# EAGLE schematic sumorobot-wifi-pcb (EAGLE 7.1.0)
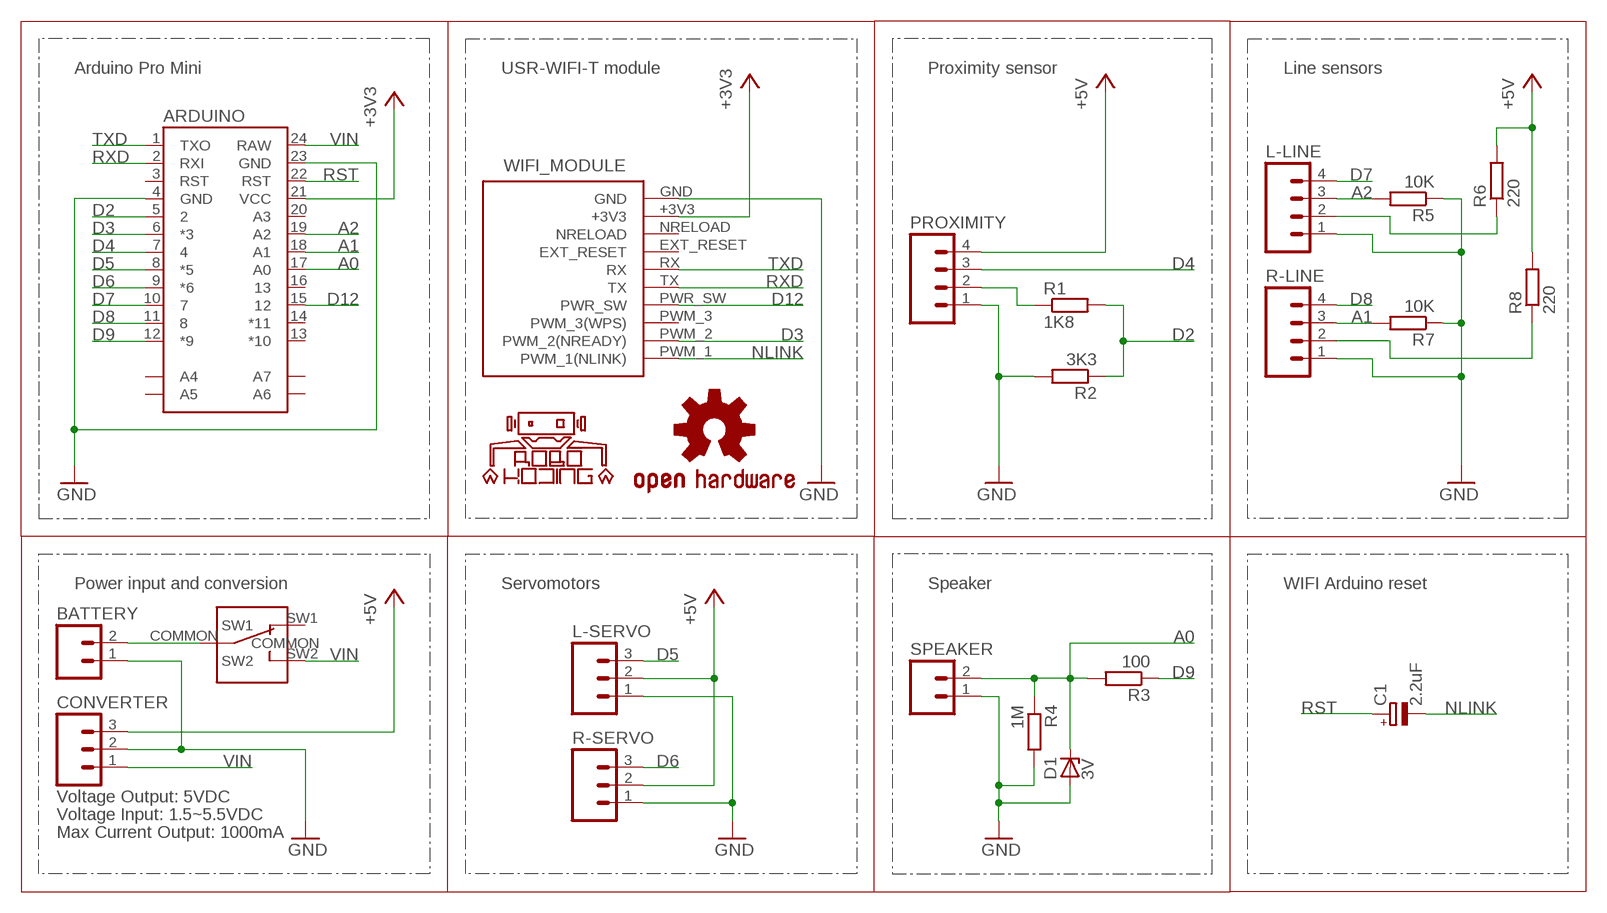
[diagram p0: schematic, sheet 1]

## Parts
ARDUINO  ARDUINO_PRO_MINI  [ARDUINO_PRO_MINI]
BATTERY  M02JST-PTH-VERT  [JST-2-PTH-VERT]
C1  2.2uF  CPOL-EUE2-5  [E2-5]
CONVERTER  M03LOCK_LONGPADS  [1X03_LOCK_LONGPADS]
D1  3V  1N821  [DO35Z10]
L-LINE  M04LOCK_LONGPADS  [1X04_LOCK_LONGPADS]
L-SERVO  M03LOCK_LONGPADS  [1X03_LOCK_LONGPADS]
LOGO1  OSHW-LOGOM  [OSHW-LOGO-M]
LOGO2  ROBOKODING-LOGOM  [ROBOKODING-LOGO-M]
POWER  SPDT_SLIDE_SWITCH  [SPDT_SLIDE_SWITCH]
PROXIMITY  M04LOCK_LONGPADS  [1X04_LOCK_LONGPADS]
R1  1K8  R-EU_0204/5  [0204/5]
R2  3K3  R-EU_0204/5  [0204/5]
R3  100  R-EU_0204/5  [0204/5]
R4  1M  R-EU_0204/5  [0204/5]
R5  10K  R-EU_0204/5  [0204/5]
R6  220  R-EU_0204/5  [0204/5]
R7  10K  R-EU_0204/5  [0204/5]
R8  220  R-EU_0204/5  [0204/5]
R-LINE  M04LOCK_LONGPADS  [1X04_LOCK_LONGPADS]
R-SERVO  M03LOCK_LONGPADS  [1X03_LOCK_LONGPADS]
SPEAKER  M02LOCK_LONGPADS  [1X02_LOCK_LONGPADS]
WIFI_MODULE  USR_WIFI-T  [WIFI_MODULE-T]

## Nets
+3V3: ARDUINO.21(VCC) WIFI_MODULE.+3V3
+5V: CONVERTER.3 L-SERVO.2 PROXIMITY.4 R6.2 R8.2 R-SERVO.2
A0: ARDUINO.17(A0) D1.C R3.2 R4.1 SPEAKER.2
A1: ARDUINO.18(A1) R7.2 R-LINE.3
A2: ARDUINO.19(A2) L-LINE.3 R5.2
BAT_IN: BATTERY.2 POWER.COMMON
D2: ARDUINO.5 R1.2 R2.1
D3: ARDUINO.6(*3) WIFI_MODULE.PWM_2(PWM_2(NREADY))
D4: ARDUINO.7 PROXIMITY.3
D5: ARDUINO.8(*5) L-SERVO.3
D6: ARDUINO.9(*6) R-SERVO.3
D7: ARDUINO.10 L-LINE.4
D8: ARDUINO.11 R-LINE.4
D9: ARDUINO.12(*9) R3.1
D12: ARDUINO.15 WIFI_MODULE.PWR_SW
GND: ARDUINO.4(GND) ARDUINO.23(GND) BATTERY.1 CONVERTER.2 D1.A L-LINE.1 L-SERVO.1 PROXIMITY.1 R2.2 R4.2 R5.1 R7.1 R-LINE.1 R-SERVO.1 SPEAKER.1 WIFI_MODULE.GND
N$1: PROXIMITY.2 R1.1
N$6: L-LINE.2 R6.1
N$7: R8.1 R-LINE.2
NLINK: C1.- WIFI_MODULE.PWM_1(PWM_1(NLINK))
RST: ARDUINO.22(RST) C1.+
RXD: ARDUINO.2(RXI) WIFI_MODULE.TX
TXD: ARDUINO.1(TXO) WIFI_MODULE.RX
VIN: ARDUINO.24(RAW) CONVERTER.1 POWER.SW2
Unconnected: ARDUINO.3(RST) ARDUINO.13(*10) ARDUINO.14(*11) ARDUINO.16 ARDUINO.20(A3) POWER.SW1 WIFI_MODULE.EXT_RESET WIFI_MODULE.NRELOAD WIFI_MODULE.PWM_3(PWM_3(WPS))

## Notes on the sheet
- Arduino Pro Mini | USR-WIFI-T module | Proximity sensor | Line sensors
- Power input and conversion | Servomotors | Speaker | WIFI Arduino reset
- Voltage Output: 5VDC
- Voltage Input: 1.5~5.5VDC
- Max Current Output: 1000mA

## Library data of the parts
ARDUINO = SparkFun-Boards:ARDUINO_PRO_MINI
BATTERY SPEAKER = SparkFun-Connectors:M02: Standard 2-pin 0.1" header. Use with - straight break away headers ( PRT-00116) - right angle break away headers (PRT-00553) - swiss pins (PRT-00743) - machine pins (PRT-00117) - female headers (PRT-00115) Molex polarized connector foot print use with: PRT-08233 with associated crimp pins and housings. 2.54_SCREWTERM for use with PRT-10571. 3.5mm Screw Terminal footprints for PRT-08084 5mm Screw Terminal footprints for use with PRT-08432
C1 = Child-Friendly-Parts:CPOL-EU: POLARIZED CAPACITOR, European symbol
CONVERTER L-SERVO R-SERVO = SparkFun-Connectors:M03: Header 3 Standard 3-pin 0.1" header. Use with straight break away headers (SKU : PRT-00116), right angle break away headers (PRT-00553), swiss pins (PRT-00743), machine pins (PRT-00117), and female headers (PRT-00115). Molex polarized connector foot print use with SKU : PRT-08232 with associated crimp pins and housings.
D1 = diode:1N821: Reference DIODE temperature compensated, 6,2 V
L-LINE PROXIMITY R-LINE = SparkFun-Connectors:M04: Header 4 Standard 4-pin 0.1" header. Use with straight break away headers (SKU : PRT-00116), right angle break away headers (PRT-00553), swiss pins (PRT-00743), machine pins (PRT-00117), and female headers (PRT-00115). Molex polarized connector foot print use with SKU : PRT-08231 with associated crimp pins and housings. 1MM SMD Version SKU: PRT-10208
LOGO1 = SparkFun-Aesthetics:OSHW-LOGO: Open Source Hardware Logo This logo indicates the piece of hardware it is found on incorporates a OSHW license and/or adheres to the definition of open source hardware found here: http://freedomdefined.org/OSHW
LOGO2 = Sumorobot:ROBOKODING-LOGO: Robokoding logo This logo indicates that the piece of hardware was developed by the RoboKoding community. RoboKoding is a organisation that focuses on teaching everyone building and programming robots: http://www.robokoding.com
POWER = custom:SPDT_SLIDE_SWITCH
R1-R8 = Child-Friendly-Parts:R-EU_: RESISTOR, European symbol
WIFI_MODULE = usr_wifi:USR_WIFI-T: USR-WIFI232-T WiFi Module